# Altium schematic sheet step-up.SchDoc
size A4
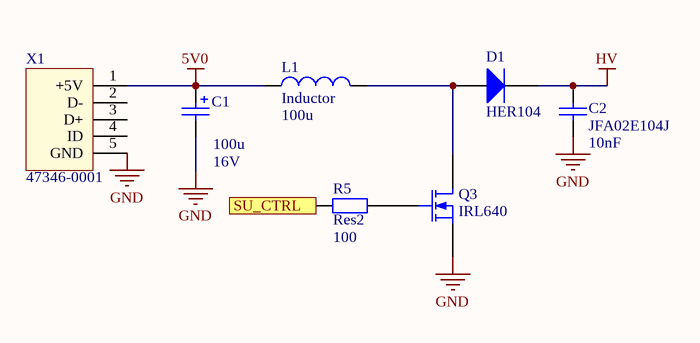
[diagram p0: step-up.SchDoc]

## Parts
C1  value 100u  Voltage: 16V  [cap_pol_5*11]  (hidden comment: Cap Pol2)
C2  JFA02E104J  value 10nF  [film_cap_10]
D1  HER104  [DO-204AL]
L1  Inductor  value 100u  [SDR0604]
Q3  IRL640  [to220_lying]
R5  Res2  value 100  [0402_res]
X1  47346-0001  [MOLEX_47346-0001]

## Ports
SU_CTRL

## Nets
5V0: C1.1 L1.1 X1.1(+5V)
GND: C1.2 C2.1 Q3.3(S) X1.5(GND)
HV: C2.2 D1.2(K)
SU_CTRL: R5.1 ; port SU_CTRL
NetD1_1: D1.1(A) L1.2 Q3.1(D)
NetQ3_2: Q3.2(G) R5.2

Not connected (* = marked no-connect by the designer): X1 2(D-) 3(D+) 4(ID)

## Library data of the parts
C1 = Cap Pol2: Polarized Capacitor (Axial); Published: 8-Jun-2000; LatestRevisionDate: 17-Jul-2002; LatestRevisionNote: Re-released for DXP Platform.; PackageReference: POLAR0.8; Publisher: Altium Limited; PackageDescription: Polarized Capacitor; 2 Leads
C2 = Cap: Capacitor; Published: 8-Jun-2000; LatestRevisionDate: 17-Jul-2002; LatestRevisionNote: Re-released for DXP Platform.; PackageReference: RAD-0.3; Publisher: Altium Limited; PackageDescription: Radial Cap, Thru-Hole; 2 Leads; 0.3 in Pin Spacing
D1 = Diode: Default Diode; Published: 8-Jun-2000; LatestRevisionDate: 17-Jul-2002; LatestRevisionNote: Re-released for DXP Platform.; PackageVersion: Sep-1996; PackageReference: SMC; Publisher: Altium Limited; PackageDescription: DO-214-AB/SMC; 2 C-Bend Leads; Body 7.9 x 5.9 mm, inc. leads (LxW); Code_JEDEC: DO-214-AB
L1 = Inductor: Code_IEC: 1005; Published: 8-Jun-2000; LatestRevisionDate: 29-May-2009; LatestRevisionNote: IPC-7351 Footprint Added.; PackageReference: 0402-A; Publisher: Altium Limited; PackageDescription: Chip Inductor; Code_JEITA: 0402
Q3 = MOSFET-N: N-Channel MOSFET; pin to pad: 1>2 2>1; Published: 8-Jun-2000; LatestRevisionDate: 17-Jul-2002; LatestRevisionNote: Re-released for DXP Platform.; PackageVersion: 1995/1996; PackageReference: E3; Publisher: Altium Limited; PackageDescription: TO, Flat Index; 3 In-Line, Axial Leads; Body Dia. 4.6mm; Lead Dia. 0.5 mm (max)
R5 = Res2: Resistor; Published: 8-Jun-2000; LatestRevisionDate: 17-Jul-2002; LatestRevisionNote: Re-released for DXP Platform.; PackageReference: AXIAL-0.4; Publisher: Altium Limited; PackageDescription: Axial Device, Thru-Hole; 2 Leads; 0.4 in Pin Spacing
X1 = micro_usb